# Altium schematic sheet NEPconn.SCHDOC
size B
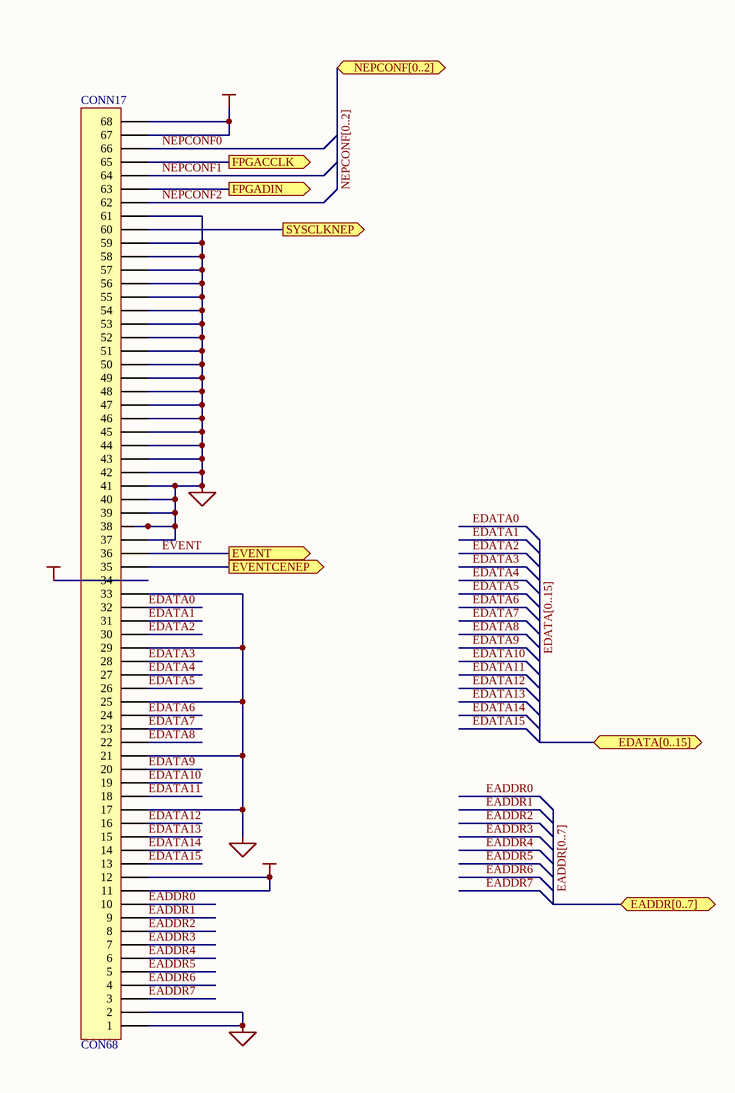
[diagram p0: NEPconn.SCHDOC]

## Parts
CONN17  CON68  [MOLEX 15921068]

## Ports
EADDR[0..7] (bidir), EDATA[0..15] (bidir), EVENT (out), EVENTCENEP (out), FPGACCLK (out), FPGADIN (out), NEPCONF[0..2] (bidir), SYSCLKNEP (out)

## Nets
+5VCC: CONN17.34
GND: CONN17.1 CONN17.2 CONN17.17 CONN17.21 CONN17.25 CONN17.29 CONN17.33 CONN17.37 CONN17.38 CONN17.39 CONN17.40 CONN17.41 CONN17.42 CONN17.43 CONN17.44 CONN17.45 CONN17.46 CONN17.47 CONN17.48 CONN17.49 CONN17.50 CONN17.51 CONN17.52 CONN17.53 CONN17.54 CONN17.55 CONN17.56 CONN17.57 CONN17.58 CONN17.59 CONN17.61
VCC: CONN17.11 CONN17.12 CONN17.67 CONN17.68
EADDR0: CONN17.10
EADDR1: CONN17.9
EADDR2: CONN17.8
EADDR3: CONN17.7
EADDR4: CONN17.6
EADDR5: CONN17.5
EADDR6: CONN17.4
EADDR7: CONN17.3
EDATA0: CONN17.32
EDATA1: CONN17.31
EDATA2: CONN17.30
EDATA3: CONN17.28
EDATA4: CONN17.27
EDATA5: CONN17.26
EDATA6: CONN17.24
EDATA7: CONN17.23
EDATA8: CONN17.22
EDATA9: CONN17.20
EDATA10: CONN17.19
EDATA11: CONN17.18
EDATA12: CONN17.16
EDATA13: CONN17.15
EDATA14: CONN17.14
EDATA15: CONN17.13
EVENT: CONN17.36 ; port EVENT
EVENTCENEP: CONN17.35 ; port EVENTCENEP
FPGACCLK: CONN17.65 ; port FPGACCLK
FPGADIN: CONN17.63 ; port FPGADIN
NEPCONF0: CONN17.66
NEPCONF1: CONN17.64
NEPCONF2: CONN17.62
SYSCLKNEP: CONN17.60 ; port SYSCLKNEP

## Buses and harness runs
bus EADDR[0..7] = port EADDR[0..7]
bus EDATA[0..15] = port EDATA[0..15]
bus NEPCONF[0..2] = port NEPCONF[0..2]